# EAGLE design controller (EAGLE 8.0.1)

## Sheet 1 of 4
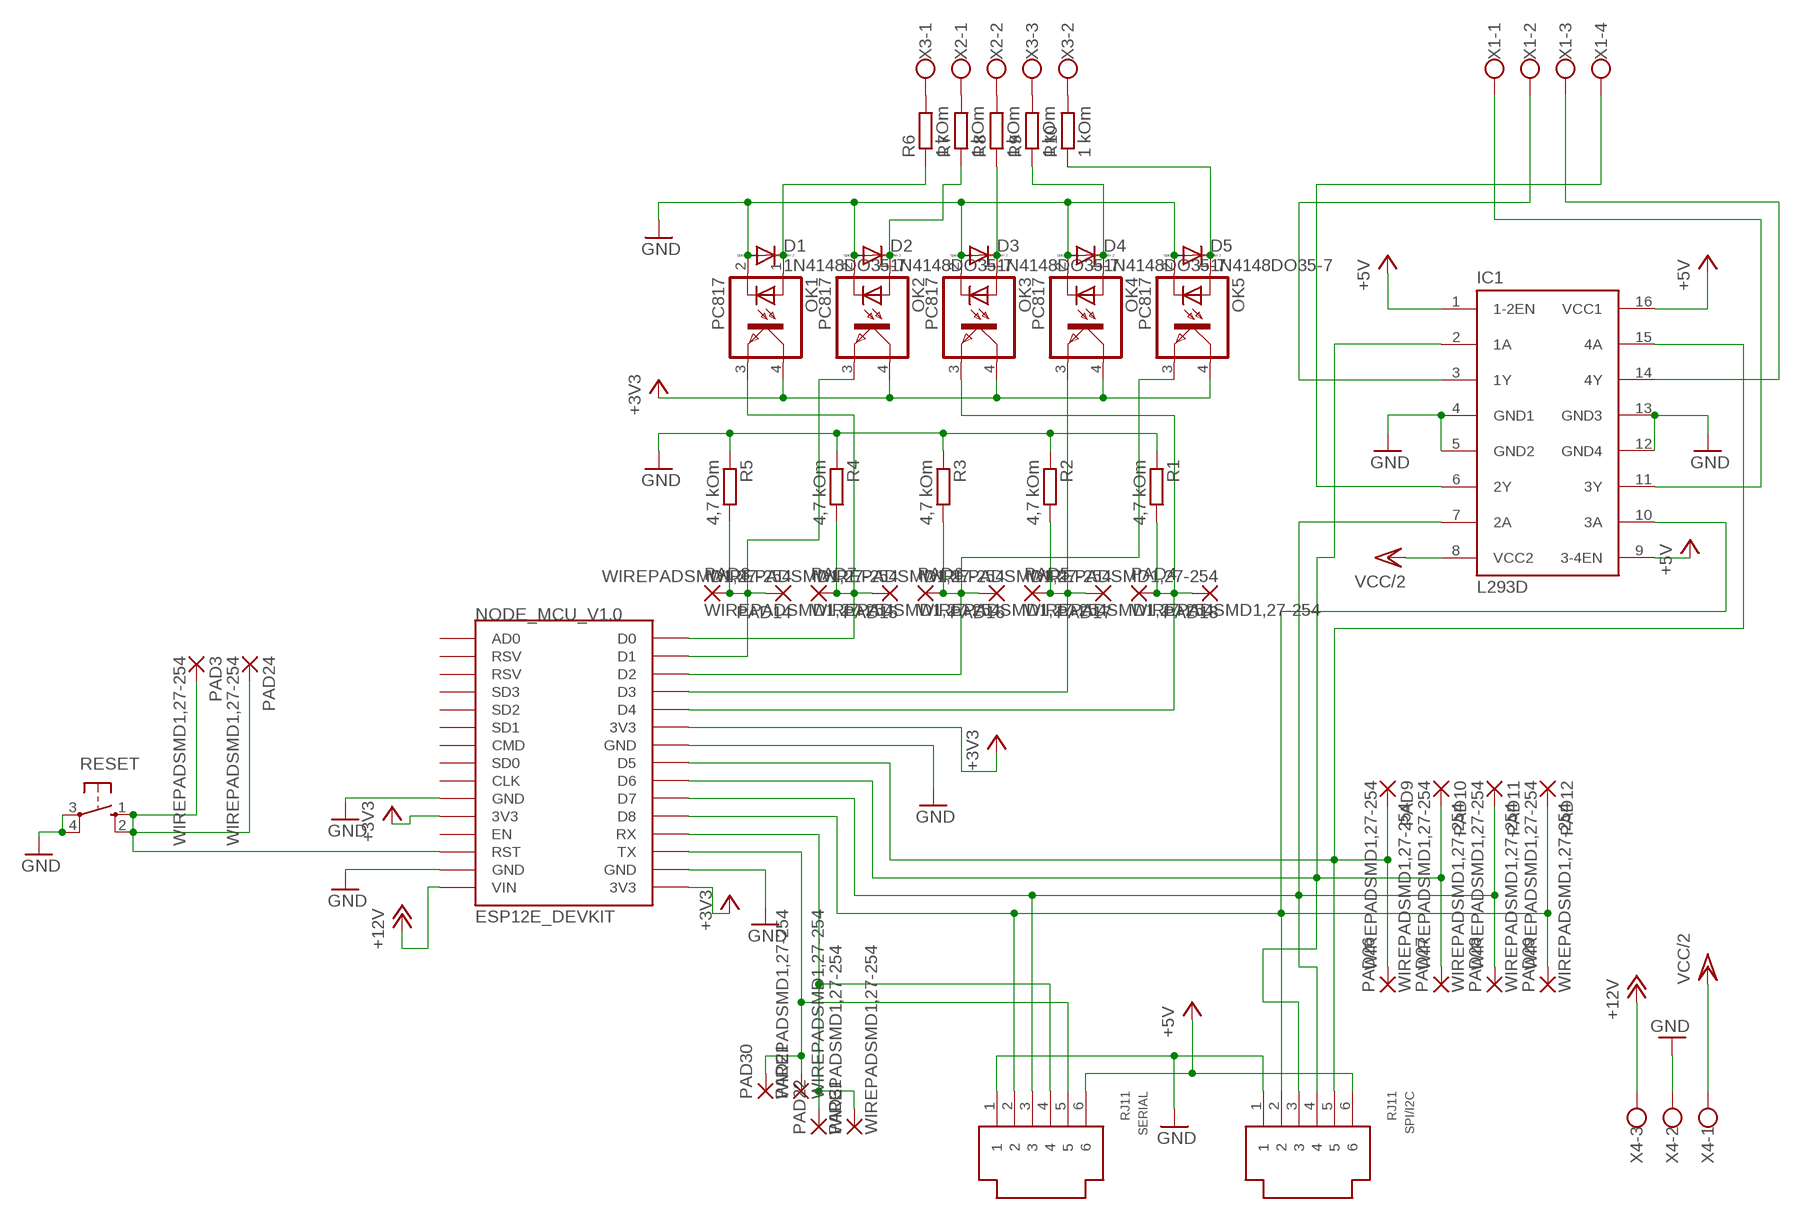
[diagram p0: schematic, sheet 1]

### Parts
D1  1N4148DO35-7  [DO35-7]
D2  1N4148DO35-7  [DO35-7]
D3  1N4148DO35-7  [DO35-7]
D4  1N4148DO35-7  [DO35-7]
D5  1N4148DO35-7  [DO35-7]
IC1  L293D  [DIL16]
NODE_MCU_V1.0  ESP12E_DEVKIT  [ESP12E_DEVKIT]
OK1  PC817  [DIL04]
OK2  PC817  [DIL04]
OK3  PC817  [DIL04]
OK4  PC817  [DIL04]
OK5  PC817  [DIL04]
PAD3  WIREPADSMD1,27-254  [SMD1,27-2,54]
PAD4  WIREPADSMD1,27-254  [SMD1,27-2,54]
PAD5  WIREPADSMD1,27-254  [SMD1,27-2,54]
PAD6  WIREPADSMD1,27-254  [SMD1,27-2,54]
PAD7  WIREPADSMD1,27-254  [SMD1,27-2,54]
PAD8  WIREPADSMD1,27-254  [SMD1,27-2,54]
PAD9  WIREPADSMD1,27-254  [SMD1,27-2,54]
PAD10  WIREPADSMD1,27-254  [SMD1,27-2,54]
PAD11  WIREPADSMD1,27-254  [SMD1,27-2,54]
PAD12  WIREPADSMD1,27-254  [SMD1,27-2,54]
PAD14  WIREPADSMD1,27-254  [SMD1,27-2,54]
PAD15  WIREPADSMD1,27-254  [SMD1,27-2,54]
PAD16  WIREPADSMD1,27-254  [SMD1,27-2,54]
PAD17  WIREPADSMD1,27-254  [SMD1,27-2,54]
PAD18  WIREPADSMD1,27-254  [SMD1,27-2,54]
PAD21  WIREPADSMD1,27-254  [SMD1,27-2,54]
PAD22  WIREPADSMD1,27-254  [SMD1,27-2,54]
PAD24  WIREPADSMD1,27-254  [SMD1,27-2,54]
PAD26  WIREPADSMD1,27-254  [SMD1,27-2,54]
PAD27  WIREPADSMD1,27-254  [SMD1,27-2,54]
PAD28  WIREPADSMD1,27-254  [SMD1,27-2,54]
PAD29  WIREPADSMD1,27-254  [SMD1,27-2,54]
PAD30  WIREPADSMD1,27-254  [SMD1,27-2,54]
PAD31  WIREPADSMD1,27-254  [SMD1,27-2,54]
R1  4,7 kOm  R-EU_0204/5  [0204/5]
R2  4,7 kOm  R-EU_0204/5  [0204/5]
R3  4,7 kOm  R-EU_0204/5  [0204/5]
R4  4,7 kOm  R-EU_0204/5  [0204/5]
R5  4,7 kOm  R-EU_0204/5  [0204/5]
R6  1 kOm  R-EU_0204/2V  [0204V]
R7  1 kOm  R-EU_0204/2V  [0204V]
R8  1 kOm  R-EU_0204/2V  [0204V]
R9  1 kOm  R-EU_0204/2V  [0204V]
R10  1 kOm  R-EU_0204/2V  [0204V]
RESET  10-XX  [B3F-10XX]
SERIAL  RJ11  [RJ11]
SPI/I2C  RJ11  [RJ11]
X1  W237-4  [W237-4]
X2  W237-102  [W237-102]
X3  W237-103  [W237-103]
X4  W237-103  [W237-103]

### Nets
+3V3: NODE_MCU_V1.0.3V3@0(3V3) NODE_MCU_V1.0.3V3@1(3V3) NODE_MCU_V1.0.3V3@2(3V3) OK1.4(COL) OK2.4(COL) OK3.4(COL) OK4.4(COL) OK5.4(COL) ; also sheet 3,4
+5V: IC1.1(1-2EN) IC1.9(3-4EN) IC1.16(VCC1) SERIAL.6 SPI/I2C.6 ; also sheet 2,4
+12V: NODE_MCU_V1.0.VIN X4.3 ; also sheet 2,3,4
GND: D1.A D2.A D3.A D4.A D5.A IC1.4(GND1) IC1.5(GND2) IC1.12(GND4) IC1.13(GND3) NODE_MCU_V1.0.GND@0(GND) NODE_MCU_V1.0.GND@1(GND) NODE_MCU_V1.0.GND@2(GND) NODE_MCU_V1.0.GND@3(GND) OK1.2(C) OK2.2(C) OK3.2(C) OK4.2(C) OK5.2(C) R1.1 R2.1 R3.1 R4.1 R5.1 RESET.3(P) RESET.4(P1) SERIAL.1 SPI/I2C.1 X4.2 ; also sheet 2,3,4
N$1: D4.C OK4.1(A) R9.1
N$2: NODE_MCU_V1.0.D4 OK3.3(EMIT) PAD4.1(P) PAD18.1(P) R1.2
N$3: NODE_MCU_V1.0.D3 OK4.3(EMIT) PAD5.1(P) PAD17.1(P) R2.2
N$4: NODE_MCU_V1.0.D2 OK5.3(EMIT) PAD6.1(P) PAD16.1(P) R3.2
N$5: NODE_MCU_V1.0.D0 OK1.3(EMIT) PAD7.1(P) PAD15.1(P) R4.2
N$6: NODE_MCU_V1.0.D1 OK2.3(EMIT) PAD8.1(P) PAD14.1(P) R5.2
N$7: D2.C OK2.1(A) R7.1
N$8: NODE_MCU_V1.0.RX PAD22.1(P) PAD31.1(P) SERIAL.4
N$9: D3.C OK3.1(A) R8.1
N$10: R8.2 X2.2
N$11: D5.C OK5.1(A) R10.1
N$12: IC1.6(2Y) X1.4
N$13: IC1.7(2A) NODE_MCU_V1.0.D7 PAD11.1(P) PAD28.1(P) SERIAL.3 SPI/I2C.4
N$14: IC1.3(1Y) X1.2
N$15: IC1.10(3A) NODE_MCU_V1.0.D8 PAD12.1(P) PAD29.1(P) SERIAL.2 SPI/I2C.2
N$16: NODE_MCU_V1.0.TX PAD21.1(P) PAD30.1(P) SERIAL.5
N$17: IC1.2(1A) NODE_MCU_V1.0.D6 PAD10.1(P) PAD27.1(P) SPI/I2C.3
N$18: NODE_MCU_V1.0.RST PAD3.1(P) PAD24.1(P) RESET.1(S) RESET.2(S1)
N$19: IC1.15(4A) NODE_MCU_V1.0.D5 PAD9.1(P) PAD26.1(P) SPI/I2C.5
N$20: IC1.11(3Y) X1.1
N$21: IC1.14(4Y) X1.3
N$22: D1.C OK1.1(A) R6.1
N$23: R7.2 X2.1
N$24: R9.2 X3.3
N$25: R10.2 X3.2
N$26: R6.2 X3.1
VCC/2: IC1.8(VCC2) X4.1 ; also sheet 4
Unconnected: NODE_MCU_V1.0.AD0 NODE_MCU_V1.0.CLK NODE_MCU_V1.0.CMD NODE_MCU_V1.0.EN NODE_MCU_V1.0.RSV@0(RSV) NODE_MCU_V1.0.RSV@1(RSV) NODE_MCU_V1.0.SD0 NODE_MCU_V1.0.SD1 NODE_MCU_V1.0.SD2 NODE_MCU_V1.0.SD3

## Sheet 2 of 4
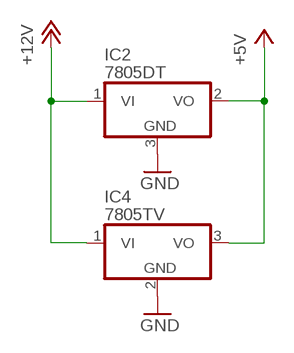
[diagram p1: schematic, sheet 2]

### Parts
IC2  7805DT  [TO252]
IC4  7805TV  [TO220V]

### Nets
+5V: IC2.2(VO) IC4.3(VO) ; also sheet 1,4
+12V: IC2.1(VI) IC4.1(VI) ; also sheet 1,3,4
GND: IC2.3(GND) IC4.2(GND) ; also sheet 1,3,4

## Sheet 3 of 4
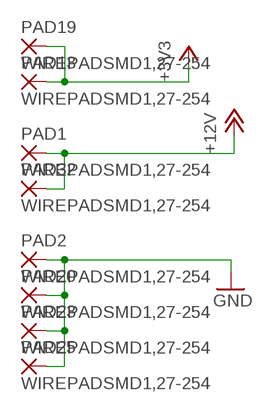
[diagram p2: schematic, sheet 3]

### Parts
PAD1  WIREPADSMD1,27-254  [SMD1,27-2,54]
PAD2  WIREPADSMD1,27-254  [SMD1,27-2,54]
PAD13  WIREPADSMD1,27-254  [SMD1,27-2,54]
PAD19  WIREPADSMD1,27-254  [SMD1,27-2,54]
PAD20  WIREPADSMD1,27-254  [SMD1,27-2,54]
PAD23  WIREPADSMD1,27-254  [SMD1,27-2,54]
PAD25  WIREPADSMD1,27-254  [SMD1,27-2,54]
PAD32  WIREPADSMD1,27-254  [SMD1,27-2,54]

### Nets
+3V3: PAD13.1(P) PAD19.1(P) ; also sheet 1,4
+12V: PAD1.1(P) PAD32.1(P) ; also sheet 1,2,4
GND: PAD2.1(P) PAD20.1(P) PAD23.1(P) PAD25.1(P) ; also sheet 1,2,4

## Sheet 4 of 4
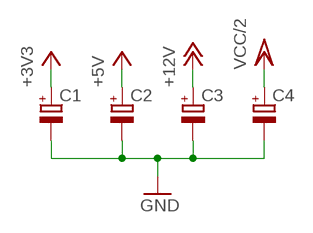
[diagram p3: schematic, sheet 4]

### Parts
C1  CPOL-EUE2.5-5  [E2,5-5]
C2  CPOL-EUE2.5-5  [E2,5-5]
C3  CPOL-EUE2.5-5  [E2,5-5]
C4  CPOL-EUE2.5-5  [E2,5-5]

### Nets
+3V3: C1.+ ; also sheet 1,3
+5V: C2.+ ; also sheet 1,2
+12V: C3.+ ; also sheet 1,2,3
GND: C1.- C2.- C3.- C4.- ; also sheet 1,2,3
VCC/2: C4.+ ; also sheet 1

## Library data of the parts
C1-C4 = resistor:CPOL-EU: POLARIZED CAPACITOR, European symbol
D1-D5 = diode:1N4148: DIODE high speed (Philips)
IC1 = st-microelectronics:L293D: PUSH-PULL 4 CHANNEL DRIVER
IC2 = linear4:78*: Positive VOLTAGE REGULATOR Source: http://cache.national.com/ds/LM/LM78L05.pdf http://www.fairchildsemi.com/ds/LM/LM7805.pdf
IC4 = linear:78*: Positive VOLTAGE REGULATOR Source: http://cache.national.com/ds/LM/LM78L05.pdf http://www.fairchildsemi.com/ds/LM/LM7805.pdf
NODE_MCU_V1.0 = ESP12E_DEVKIT:ESP12E_DEVKIT: ESP12E DEVKIT BOARD
OK1-OK5 = optocoupler:PC817: SHARP OPTO COUPLER; MPN: PC817X4J000F; OC_FARNELL: 9707727; OC_NEWARK: 97K7059
PAD1-PAD32 = wirepad:WIREPAD: Wire PAD connect wire on PCB
R1-R10 = resistor:R-EU_: RESISTOR, European symbol
RESET = switch-omron:10-XX: OMRON SWITCH; MPN: B3F-1000; OC_FARNELL: 176432; OC_NEWARK: 36M3542
SERIAL SPI/I2C = con-rj-11-6P6:RJ11: RJ11, RJ22 RJ11 and RJ22 jacks side mounted http://www.tycoelectronics.com
X1 = con-wago-500:W237-4: WAGO SCREW CLAMP; OC_FARNELL: unknown; OC_NEWARK: unknown
X2 = con-wago-500:W237-102: WAGO SCREW CLAMP; MPN: 237-102; OC_FARNELL: unknown; OC_NEWARK: 70K9898
X3 X4 = con-wago-500:W237-103: WAGO SCREW CLAMP; MPN: 237-103; OC_FARNELL: unknown; OC_NEWARK: 18M7116

## Board
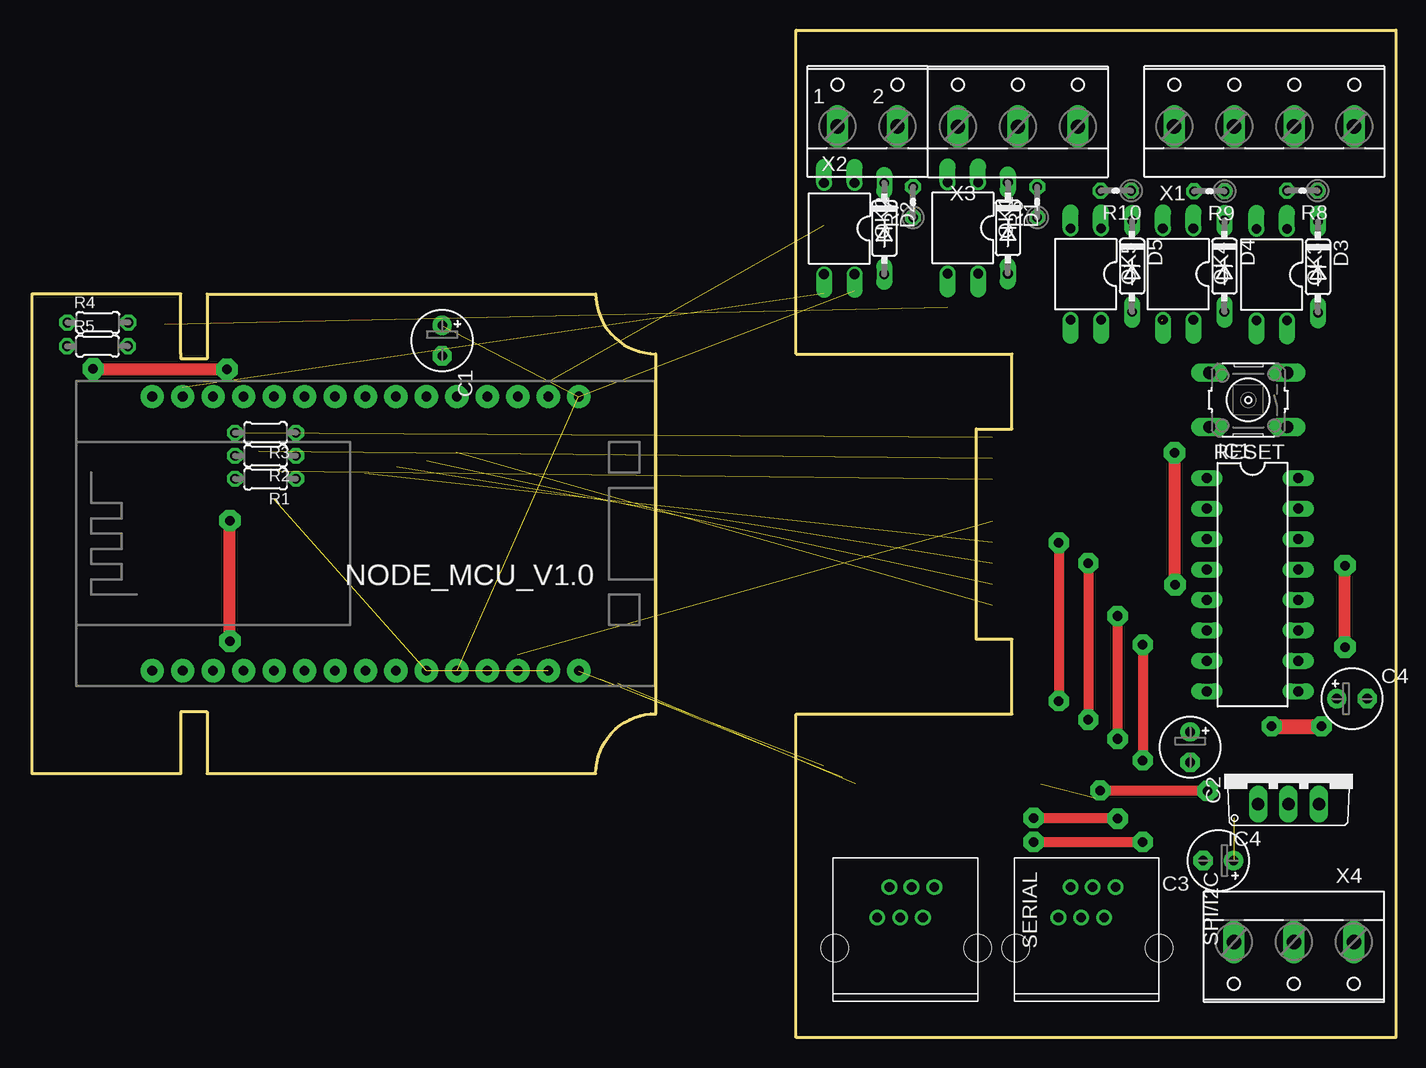
[diagram p4: board, top side]
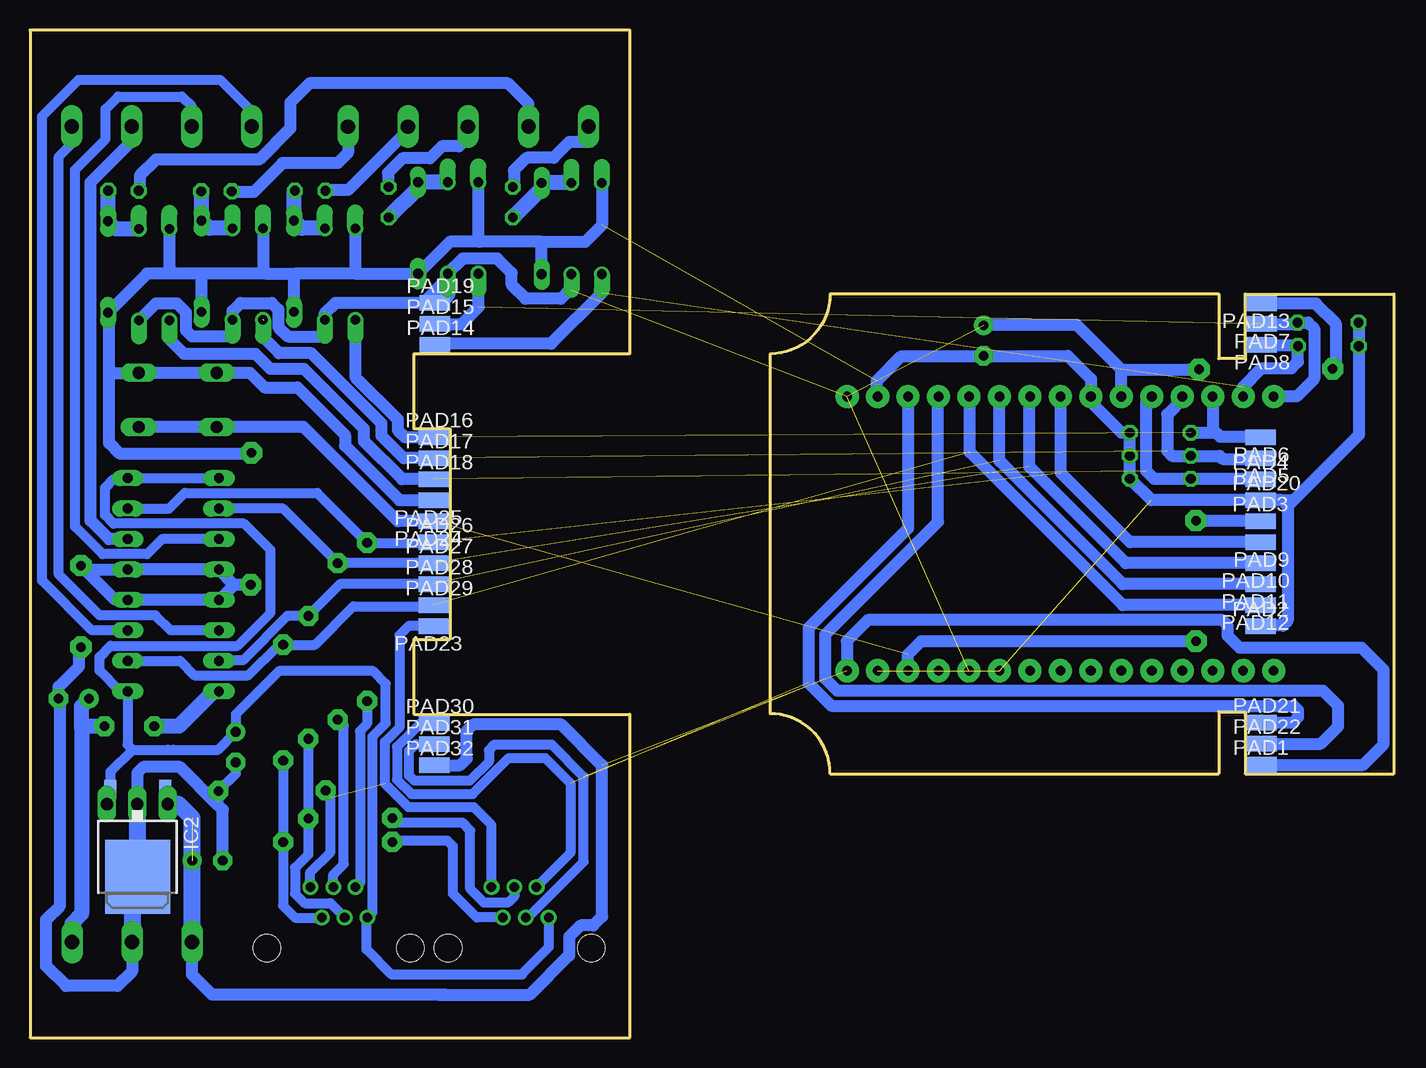
[diagram p5: board, bottom side, seen from below]

Size 113.7 x 84 mm. Coordinates in mm from the lower left corner, seen from the top.
Outline: 12.4,57 12.4,62 0,62 0,22 12.4,22 12.4,26.85 12.4,27 12.4,27.15 14.6,27.15 14.6,22 47,22 arc-91 52.05,27
Outline: 52,27 52,57 arc-90 47,62 14.6,62 14.6,56.6 12.4,56.6 12.4,57.05
Outline: 63.7,0 63.7,26.95 81.7,26.95 81.7,33.2 78.7,33.2 78.7,50.75 81.7,50.75 81.7,57 63.7,57 63.7,84 113.7,84 113.7,0 63.7,0
Copper layers (1*16): Top 0.035mm / dielectric 1.5mm / Bottom 0.035mm
Design rules "default": minimum track width 10mil, minimum drill 24mil, track to track 8mil, track to pad 8mil, pad to pad 8mil, via to via 8mil, smd to smd 8mil, copper to edge 40mil, drill to drill 8mil, minimum pad ring 10mil, minimum via ring 8mil, stop-mask expansion 4mil, vias tented up to drill 0mil, thermal gap 10mil

### Footprints (pad centres in the part's own frame; a part is rotated, then mirrored left to right if it is on the bottom)
E2,5-5 = drill 0.813 pad 1.6: + -1.27,0 | drill 0.813 pad 1.6 octagon: - 1.27,0
DO35-7 = drill 0.813 long: A 3.81,0; C -3.81,0
DIL16 = drill 0.813 long: 1 -8.89,-3.81; 2 -6.35,-3.81; 3 -3.81,-3.81; 4 -1.27,-3.81; 5 1.27,-3.81; 6 3.81,-3.81; 7 6.35,-3.81; 8 8.89,-3.81; 9 8.89,3.81; 10 6.35,3.81; 11 3.81,3.81; 12 1.27,3.81; 13 -1.27,3.81; 14 -3.81,3.81; 15 -6.35,3.81; 16 -8.89,3.81
TO252 = smd 1 x 1.6: 1 -2.28,-4.8; 2 2.28,-4.8 | smd 5.4 x 6.2: 3 0,2.5
TO220V = drill 1.016 long: 1 -2.54,-2.54; 2 0,-2.54; 3 2.54,-2.54
ESP12E_DEVKIT = drill 0.8 pad 1.93: 3V3@0 -11.43,-7.62; 3V3@1 11.43,5.08; 3V3@2 11.43,-17.78; AD0 -11.43,17.78; CLK -11.43,-2.54; CMD -11.43,2.54; D0 11.43,17.78; D1 11.43,15.24; D2 11.43,12.7; D3 11.43,10.16; D4 11.43,7.62; D5 11.43,0; D6 11.43,-2.54; D7 11.43,-5.08; D8 11.43,-7.62; EN -11.43,-10.16; GND@0 -11.43,-5.08; GND@1 -11.43,-15.24; GND@2 11.43,2.54; GND@3 11.43,-15.24; RST -11.43,-12.7; RSV@0 -11.43,15.24; RSV@1 -11.43,12.7; RX 11.43,-10.16; SD0 -11.43,0; SD1 -11.43,5.08; SD2 -11.43,7.62; SD3 -11.43,10.16; TX 11.43,-12.7; VIN -11.43,-17.78
DIL04 = drill 0.813 offset: 1 -1.27,-3.81; 2 1.27,-3.81; 3 1.27,3.81; 4 -1.27,3.81
SMD1,27-2,54 = smd 1.27 x 2.54: 1 0,0
0204/5 = drill 0.813 octagon: 1 -2.54,0; 2 2.54,0
0204V = drill 0.813 octagon: 1 -1.27,0; 2 1.27,0
B3F-10XX = drill 1.016 long: 1 -3.251,2.261; 2 3.251,2.261; 3 -3.251,-2.261; 4 3.251,-2.261
RJ11 = drill 0.8: 1 -6.35,0.826; 2 -3.81,-0.127; 3 -6.35,-1.079; 4 -3.81,-2.032; 5 -6.35,-2.921; 6 -3.81,-3.937 | hole 2.286: -1.27,-7.493; -1.27,4.445
W237-4 = drill 1.194 long: 1 -7.5,-1.27; 2 -2.5,-1.27; 3 2.5,-1.27; 4 7.5,-1.27
W237-102 = drill 1.194 long: 1 -2.5,-1.27; 2 2.5,-1.27
W237-103 = drill 1.194 long: 1 -5,-1.29; 2 0,-1.29; 3 5,-1.29

### Placement (x,y rotation side)
C1  34.2,58.1 270 top
C2  96.55,24.2 270 top
C3  98.9,14.75 180 top
C4  110.05,28.25 0 top
D1  81.35,67.5 270 top
D2  71.05,67.45 270 top
D3  107.2,64.25 270 top
D4  99.4,64.3 270 top
D5  91.7,64.3 270 top
IC1  101.75,37.75 270 top
IC2  104.73,15.9 180 bottom
IC4  104.75,22 0 top
NODE_MCU_V1.0  27.8,42.01 90 top
OK1  77.6,67.5 180 top
OK2  67.3,67.45 180 top
OK3  103.35,63.6 180 top
OK4  95.55,63.65 180 top
OK5  87.85,63.65 180 top
PAD1  11.05,22.75 270 bottom
PAD2  11.1,34.3 270 bottom
PAD3  11.1,43.05 270 bottom
PAD4  11.1,46.55 270 bottom
PAD5  11.1,48.3 90 bottom
PAD6  11.1,50.05 90 bottom
PAD7  11.05,59.5 90 bottom
PAD8  11.05,57.75 90 bottom
PAD9  11.1,41.3 90 bottom
PAD10  11.1,39.55 90 bottom
PAD11  11.1,37.8 90 bottom
PAD12  11.1,36.05 90 bottom
PAD13  11.05,61.2 90 bottom
PAD14  79.95,57.75 270 bottom
PAD15  79.95,59.5 270 bottom
PAD16  80.05,50.05 270 bottom
PAD17  80.05,48.3 270 bottom
PAD18  80.05,46.55 270 bottom
PAD19  79.95,61.25 270 bottom
PAD20  11.1,44.8 270 bottom
PAD21  11.05,26.25 270 bottom
PAD22  11.05,24.5 270 bottom
PAD23  80.05,34.3 90 bottom
PAD24  80.05,43.05 90 bottom
PAD25  80.05,44.8 90 bottom
PAD26  80.05,41.3 270 bottom
PAD27  80.05,39.55 270 bottom
PAD28  80.05,37.8 270 bottom
PAD29  80.05,36.05 270 bottom
PAD30  80,26.2 270 bottom
PAD31  80,24.45 270 bottom
PAD32  80,22.7 270 bottom
R1  19.47,46.58 180 top
R2  19.47,48.5 180 top
R3  19.47,50.42 180 top
R4  5.49,59.61 0 top
R5  5.46,57.64 0 top
R6  83.8,69.65 90 top
R7  73.45,69.65 90 top
R8  105.9,70.6 180 top
R9  98.15,70.55 180 top
R10  90.35,70.6 180 top
RESET  101.39,53.16 180 top
SERIAL  74.4,6.2 270 top
SPI/I2C  89.5,6.2 270 top
X1  102.72,77.23 0 top
X2  69.64,77.23 0 top
X3  82.19,77.23 0 top
X4  105.2,6.68 180 top

### Tracks (layer width: path | path; a pad name or v marks a point on that pad's centre or on a via)
+3V3  (via drill 0.8 pad 1.78)  (3 unrouted)
  Top 1.016: v16.25,55.7 5.1,55.7 v5.1,55.75
  Bottom 1.016: PAD13.1 6.5,61.2 4.85,59.55 4.85,56 v5.1,55.75 | NODE_MCU_V1.0.3V3@1 22.72,55.67 | 22.69,55.7 22.72,55.67 | 22.72,55.67 26.45,59.4 34.17,59.4 C1.+ | OK3.4 103.21,61.2 101.45,61.2 100.7,60.45 100.7,58.95 100.2,58.45 96.85,58.45 96.82,58.48 OK4.4 96.82,60.58 96.15,61.25 93.55,61.25 93,60.7 93,59.25 92.2,58.45 89.35,58.45 89.1,58.7 89.1,59.82 OK5.4 89.12,60.38 88.25,61.25 80.95,61.25 | 80.95,61.25 PAD19.1 | OK2.4 68.57,62.28 68.65,62.2 68.85,62.2 69.45,61.6 72.4,61.6 73.55,62.75 73.55,63.75 74.75,64.95 77.61,64.95 OK1.4 78.87,63.33 80.95,61.25 | 22.72,55.67 16.32,55.67 16.3,55.65 v16.25,55.7
  Bottom 1.27: PAD19.1 79.55,61.25 78.85,61.95 78.85,63.67 OK1.4
+5V
  Bottom 0.61: 105.6,28.9 IC1.9
  Bottom 0.813: SERIAL.6 70.46,7.54 72.65,5.35 72.65,5.25 83.55,5.25 85.65,7.35 85.65,9.92 SPI/I2C.6 85.15,10.42 85.15,25.1 84.05,26.2 84.05,29.5 85.1,30.55 92.95,30.55 96.55,26.95 C2.+ 98.02,24 102.2,24 | 105.15,24 102.2,24 | 102.2,24 101.75,24 | 105.15,24 107,22.15 IC2.2 107.01,19.74 IC4.3 | 105.15,24 105.56,24.41 IC1.9 106.16,28.86 107.9,30.6 107.9,31.75 107,32.65 96.4,32.65 93.65,35.4 93.65,40.65 95.85,42.85 106.75,42.85 107.45,43.55 107.45,45.85 106.75,46.55 105.65,46.55 IC1.16 IC1.1
+12V  (2 unrouted)
  Bottom 0.305: IC4.1 102.21,20.94 IC2.1
  Bottom 1.016: NODE_MCU_V1.0.VIN 45.6,30.6 45.6,33.05 43.85,34.8 14.3,34.8 13.85,34.35 13.85,33.5 12.85,32.5 2.7,32.5 0.85,30.65 0.85,24.45 2.55,22.75 PAD1.1 | PAD32.1 77.85,22.7 77.3,23.25 77.3,25.55 76.75,26.1 69.4,26.1 66,22.7 66,10.1 66.75,9.35 67.8,9.35 68.75,8.4 68.75,6.85 72.03,3.57 79.7,3.57 | X4.3 100.2,5.25 98.53,3.57 79.7,3.57 | IC2.1 102.45,19.7 IC4.1 | 79.12,3.57 79.7,3.57
  Bottom 1.422: IC4.1 101.36,19.46 100.2,18.3 X4.3
GND  (via drill 0.8 pad 1.68, 0.8 pad 1.78)  (4 unrouted)
  Top 0.813: v98,20.55 97.95,20.6 v89.05,20.6
  Top 1.016: v109.45,32.55 v109.45,39.35 109.45,39.4 | v95.3,37.75 95.25,37.8 v95.25,48.75
  Bottom 0.61: IC2.3 104.73,13.88 | 97.85,14.53 C3.-
  Bottom 0.813: PAD23.1 82.15,34.3 82.9,33.55 82.9,25.85 84.1,24.65 84.1,21.15 82.15,19.2 76.7,19.2 75.23,17.73 SERIAL.1 | SPI/I2C.1 90.33,13.77 88.65,15.45 88.65,20 89.05,20.4 v89.05,20.6 | 98.03,19.38 98,19.4 v98,20.55 96.55,22 C2.-
  Bottom 1.016: R4.1 2.95,57.67 R5.1 2.92,50.23 8.35,44.8 | PAD20.1 9.35,44.8 8.85,44.3 | 8.85,44.3 8.85,34.75 9.25,34.35 11.05,34.35 PAD2.1 | 8.35,44.8 8.85,44.3 | PAD20.1 8.35,44.8 | IC1.5 IC1.12 106.58,36.48 109.12,39.02 | RESET.4 RESET.3 104.66,55.4 107.1,55.4 | 80.1,44.75 PAD25.1 82.9,44.8 87.45,49.35 87.45,50.25 91.4,54.2 94.15,54.2 95.37,55.42 RESET.4 | X4.2 105.2,5.5 106.4,4.3 110.7,4.3 112.35,5.95 112.35,9.85 111.2,11 111.2,28.13 C4.- 111.32,29.23 109.6,30.95 109.6,32.5 109.5,32.5 v109.45,32.55 | IC1.5 97.52,36.48 | NODE_MCU_V1.0.GND@3 43.1,53.5 43.1,54.75 41.05,56.8 34.23,56.8 C1.- 27.18,56.83 25.26,54.91 NODE_MCU_V1.0.GND@2 25.26,52.96 22.72,50.42 R3.1 R2.1 R1.1 20.23,44.8 PAD20.1 | RESET.4 98.14,55.29 | 107.1,55.4 107.1,49.55 106.25,48.7 95.45,48.7 95.4,48.65 95.35,48.65 v95.25,48.75 | 97.2,55.4 98.12,55.4 RESET.4 | 107.1,55.4 107.1,59.39 D3.A 103.95,63.69 101.65,63.69 | OK2.2 66.03,67.72 67.4,66.35 71.1,66.35 | 71.1,66.35 76.25,66.35 | 76.25,66.35 78.69,66.35 D1.A 86.6,63.69 | OK1.2 76.33,66.43 76.25,66.35 | D2.A 71.05,66.3 71.1,66.35 | 99.5,63.69 101.65,63.69 | 94.1,63.69 91.55,63.69 | 94.1,63.69 99.5,63.69 | 86.6,63.69 91.55,63.69 | OK3.2 102.08,64.12 101.65,63.69 | D4.A 99.4,63.59 99.5,63.69 | D5.A 91.7,63.54 91.55,63.69 | OK5.2 86.58,63.71 86.6,63.69 | OK4.2 94.28,63.87 94.1,63.69 | C3.- 97.63,18.98 98.03,19.38 101.2,22.55 104.25,22.55 104.75,22.05 IC4.2 | 109.12,39.02 IC1.13 IC1.4 96.67,37.75 | 109.12,39.02 v109.45,39.35 | v95.3,37.75 96.67,37.75 | 96.67,37.75 IC1.5
  Bottom 1.422: 104.73,14.2 IC2.3 105.2,12.93 X4.2 | 106.3,12.63 104.73,14.2 | IC4.2 104.75,14.22 104.73,14.2
N$1
  Bottom 1.27: OK4.1 98.75,67.46 D4.C 99.4,70.53 R9.1
N$2  (1 unrouted)
  Bottom 0.61: 11.13,46.58 PAD4.1
  Bottom 1.016: PAD18.1 82.7,46.55 85.85,49.7 85.85,50.75 90.85,55.75 93.65,55.75 94.9,57 100.85,57 102.05,58.2 102.05,59.76 OK3.3 | PAD4.1 16.9,46.55 R1.2 19.98,46.58 20.65,47.25 20.65,52.97 NODE_MCU_V1.0.D4
N$3  (2 unrouted)
  Bottom 1.016: PAD17.1 82.55,48.3 84.4,50.15 84.4,51.2 90.25,57.05 92.95,57.05 94.2,58.3 94.2,59.76 | PAD5.1 11.15,48.25 14.3,48.25 14.55,48.5 R2.2 18.5,48.5 18.9,48.9 18.9,51.95 17.64,53.21 NODE_MCU_V1.0.D3
N$4  (1 unrouted)
  Bottom 0.61: PAD16.1 80.15,49.95
  Bottom 1.016: OK5.3 86.58,55.08 83.05,51.55 83.05,50.65 82.45,50.05 PAD16.1 | NODE_MCU_V1.0.D2 15.1,50.7 14.5,50.1 | 14.5,50.1 11.15,50.1 PAD6.1 | R3.2 14.82,50.42 14.5,50.1
N$5  (1 unrouted)
  Bottom 0.61: 76.3,63.66 OK1.3 76.35,63.67
  Bottom 1.016: PAD15.1 77.7,59.5 76.3,60.9 76.3,63.66 OK1.3 | PAD7.1 8.14,59.5 R4.2 7.16,59.61 6.65,59.1 6.65,54.9 8.1,53.45 NODE_MCU_V1.0.D0
N$6  (1 unrouted)
  Bottom 0.61: 66,63.61 OK2.3
  Bottom 1.016: OK2.3 66.03,62.07 70.25,57.85 79.85,57.85 PAD14.1 | PAD8.1 8.11,57.75 R5.2 8,56.35 8.55,55.8 11,55.8 12.56,54.24 NODE_MCU_V1.0.D1
N$7
  Bottom 0.61: OK2.1 D2.C
  Bottom 1.27: OK2.1 D2.C 71.05,70.78 R7.1
N$8  (1 unrouted)
  Bottom 0.61: 81.55,24.45 80.45,24.45 PAD31.1
  Bottom 0.813: SERIAL.4 72.19,10.01 67.55,14.65 67.55,21.75 70.2,24.4 75,24.4 75.45,23.95 75.45,23 77.05,21.4 81.65,21.4 82.1,21.85 82.1,23.9 81.55,24.45 80.45,24.45
  Bottom 1.016: PAD22.1 6.1,24.5 4.65,25.95 4.65,27.65 5.9,28.9 46.4,28.9 47.4,29.9 47.4,33.6 38,43 38,53.4 NODE_MCU_V1.0.RX
N$9
  Bottom 1.27: OK3.1 106.55,67.41 D3.C 107.2,70.57 R8.1
N$10
  Bottom 1.016: X2.2 72.14,77.84 73.85,79.55 90.4,79.55 92,77.95 92,75.8 94.6,73.2 103.2,73.2 104.55,71.85 104.55,70.68 R8.2
N$11
  Bottom 1.27: OK5.1 91.05,67.46 D5.C 91.7,70.52 R10.1
N$12
  Bottom 0.813: IC1.6 101.99,33.94 103.25,35.2 107.9,35.2 111.3,38.6 111.3,73.45 110.15,74.6 110.15,75.89 X1.4
N$13  (via drill 0.8 pad 1.68)  (1 unrouted)
  Top 0.813: v90.5,35.15 v90.5,24.9 | v83.5,18.3 90.4,18.3 90.5,18.4 v90.5,18.25
  Bottom 0.61: 80.1,37.85 PAD28.1
  Bottom 0.813: PAD28.1 87.85,37.8 v90.5,35.15 92.25,35.15 95.95,31.45 97.89,31.45 IC1.7 | v90.5,24.9 v90.5,18.25 90.5,15.25 91.6,14.15 91.6,12 90.8,11.2 88.66,11.2 SPI/I2C.4 | SERIAL.3 73.32,11.78 73.85,11.25 75.85,11.25 77,12.4 77,17.25 77.65,17.9 83,17.9 83.55,18.45 83.55,18.35 v83.5,18.3
  Bottom 1.016: PAD11.1 22.6,37.8 32.9,48.1 32.9,53.42 NODE_MCU_V1.0.D7
N$14
  Bottom 0.813: IC1.3 102.69,41.56 103.95,40.3 107.65,40.3 109.95,42.6 109.95,72.35 107.4,74.9 107.4,77.4 106.35,78.45 101.05,78.45 100.2,77.6 100.2,75.98 X1.2
N$15  (via drill 0.8 pad 1.68)  (1 unrouted)
  Top 0.813: v92.6,32.75 v92.6,23.1 | v83.5,16.3 v92.6,16.3
  Bottom 0.813: IC1.10 101.2,31.4 100,30.2 95.5,30.2 92.95,32.75 v92.6,32.75 89.95,32.75 86.75,35.95 80.15,35.95 PAD29.1 | v92.6,23.1 v92.6,16.3 92.6,11 91.6,10 89.38,10 SPI/I2C.2 | SERIAL.2 76.46,10.01 78.45,12 78.45,15.95 78.9,16.4 83.4,16.4 v83.5,16.3
  Bottom 1.016: PAD12.1 22.6,36.05 35.35,48.8 35.35,53.37 NODE_MCU_V1.0.D8
N$16  (1 unrouted)
  Bottom 0.61: PAD21.1 11.05,26.65 | 81.05,26.2 PAD30.1
  Bottom 0.813: PAD30.1 81.15,26.2 83.1,24.25 83.1,21.5 81.9,20.3 76.8,20.3 73.8,23.3 70.75,23.3 68.65,21.2 68.65,15.38 SERIAL.5
  Bottom 1.016: NODE_MCU_V1.0.TX 40.5,42.45 48.8,34.15 48.8,29.55 46.9,27.65 8.35,27.65 8,27.3 8,26.7 8.45,26.25 PAD21.1
N$17  (via drill 0.8 pad 1.68)  (1 unrouted)
  Top 0.813: v88.05,39.55 v88.05,26.5 88.05,26.3
  Bottom 0.813: PAD27.1 v88.05,39.55 92.6,44.1 IC1.2 | SPI/I2C.3 88.42,13.58 87.55,14.45 87.55,26 v88.05,26.5
  Bottom 1.016: PAD10.1 22.35,39.55 30.4,47.6 30.4,53.38 NODE_MCU_V1.0.D6
N$18  (via drill 0.8 pad 1.78)  (1 unrouted)
  Top 1.016: v16.5,33.05 v16.5,43.1
  Bottom 1.016: NODE_MCU_V1.0.RST 40.5,31.95 39.4,33.05 v16.5,33.05 16.45,33 | PAD24.1 83.05,43.05 90.9,50.9 RESET.2 RESET.1 | v16.5,43.1 11.15,43.1 PAD3.1
N$19  (via drill 0.8 pad 1.68)  (1 unrouted)
  Top 0.813: v85.6,41.25 v85.6,28.05
  Bottom 0.813: SPI/I2C.5 86.15,12.98 86.2,13.03 86.2,25.55 85.6,26.15 v85.6,28.05 | IC1.15 102.1,44.1 100.8,45.4 89.75,45.4 v85.6,41.25 80.1,41.25 PAD26.1
  Bottom 1.016: PAD9.1 22,41.3 27.75,47.05 27.75,53.39 NODE_MCU_V1.0.D5
N$20
  Bottom 0.813: IC1.11 108.54,33.94 112.7,38.1 112.7,76.8 109.65,79.85 97.85,79.85 95.15,77.15 95.15,76.03 X1.1
N$21
  Bottom 1.016: IC1.14 107.11,41.56 108.65,43.1 108.65,71.3 105.15,74.8 105.15,75.89 X1.3
N$22
  Bottom 0.61: 78.9,71.34 OK1.1 D1.C
  Bottom 1.27: OK1.1 D1.C 81.35,70.83 R6.1
N$23
  Bottom 1.016: X2.1 67,75.96 67,74.65 68.75,74.65 70.05,73.35 72.3,73.35 73.35,72.3 73.35,71.02 R7.2
N$24
  Bottom 1.016: X3.3 87.19,73.76 88.05,72.9 92.65,72.9 95.05,70.5 96.83,70.5 R9.2
N$25
  Bottom 1.016: X3.2 82.19,75.66 87.2,70.65 89.03,70.65 R10.2
N$26
  Bottom 1.016: X3.1 77.19,75.06 77.95,74.3 79.35,74.3 80.35,73.3 82.65,73.3 83.85,72.1 83.85,70.97 R6.2
VCC/2  (via drill 0.8 pad 1.68)
  Top 1.27: v103.35,25.95 v107.5,25.95
  Bottom 1.27: X4.1 110.2,9.5 109.4,10.3 109.4,25.85 | 109.4,25.85 109.4,27.63 C4.+ | IC1.8 98.39,28.86 101.3,25.95 v103.35,25.95 | v107.5,25.95 109.3,25.95 109.4,25.85